# EasyEDA Pro project split36_left.eprj

# Schematic split1_left
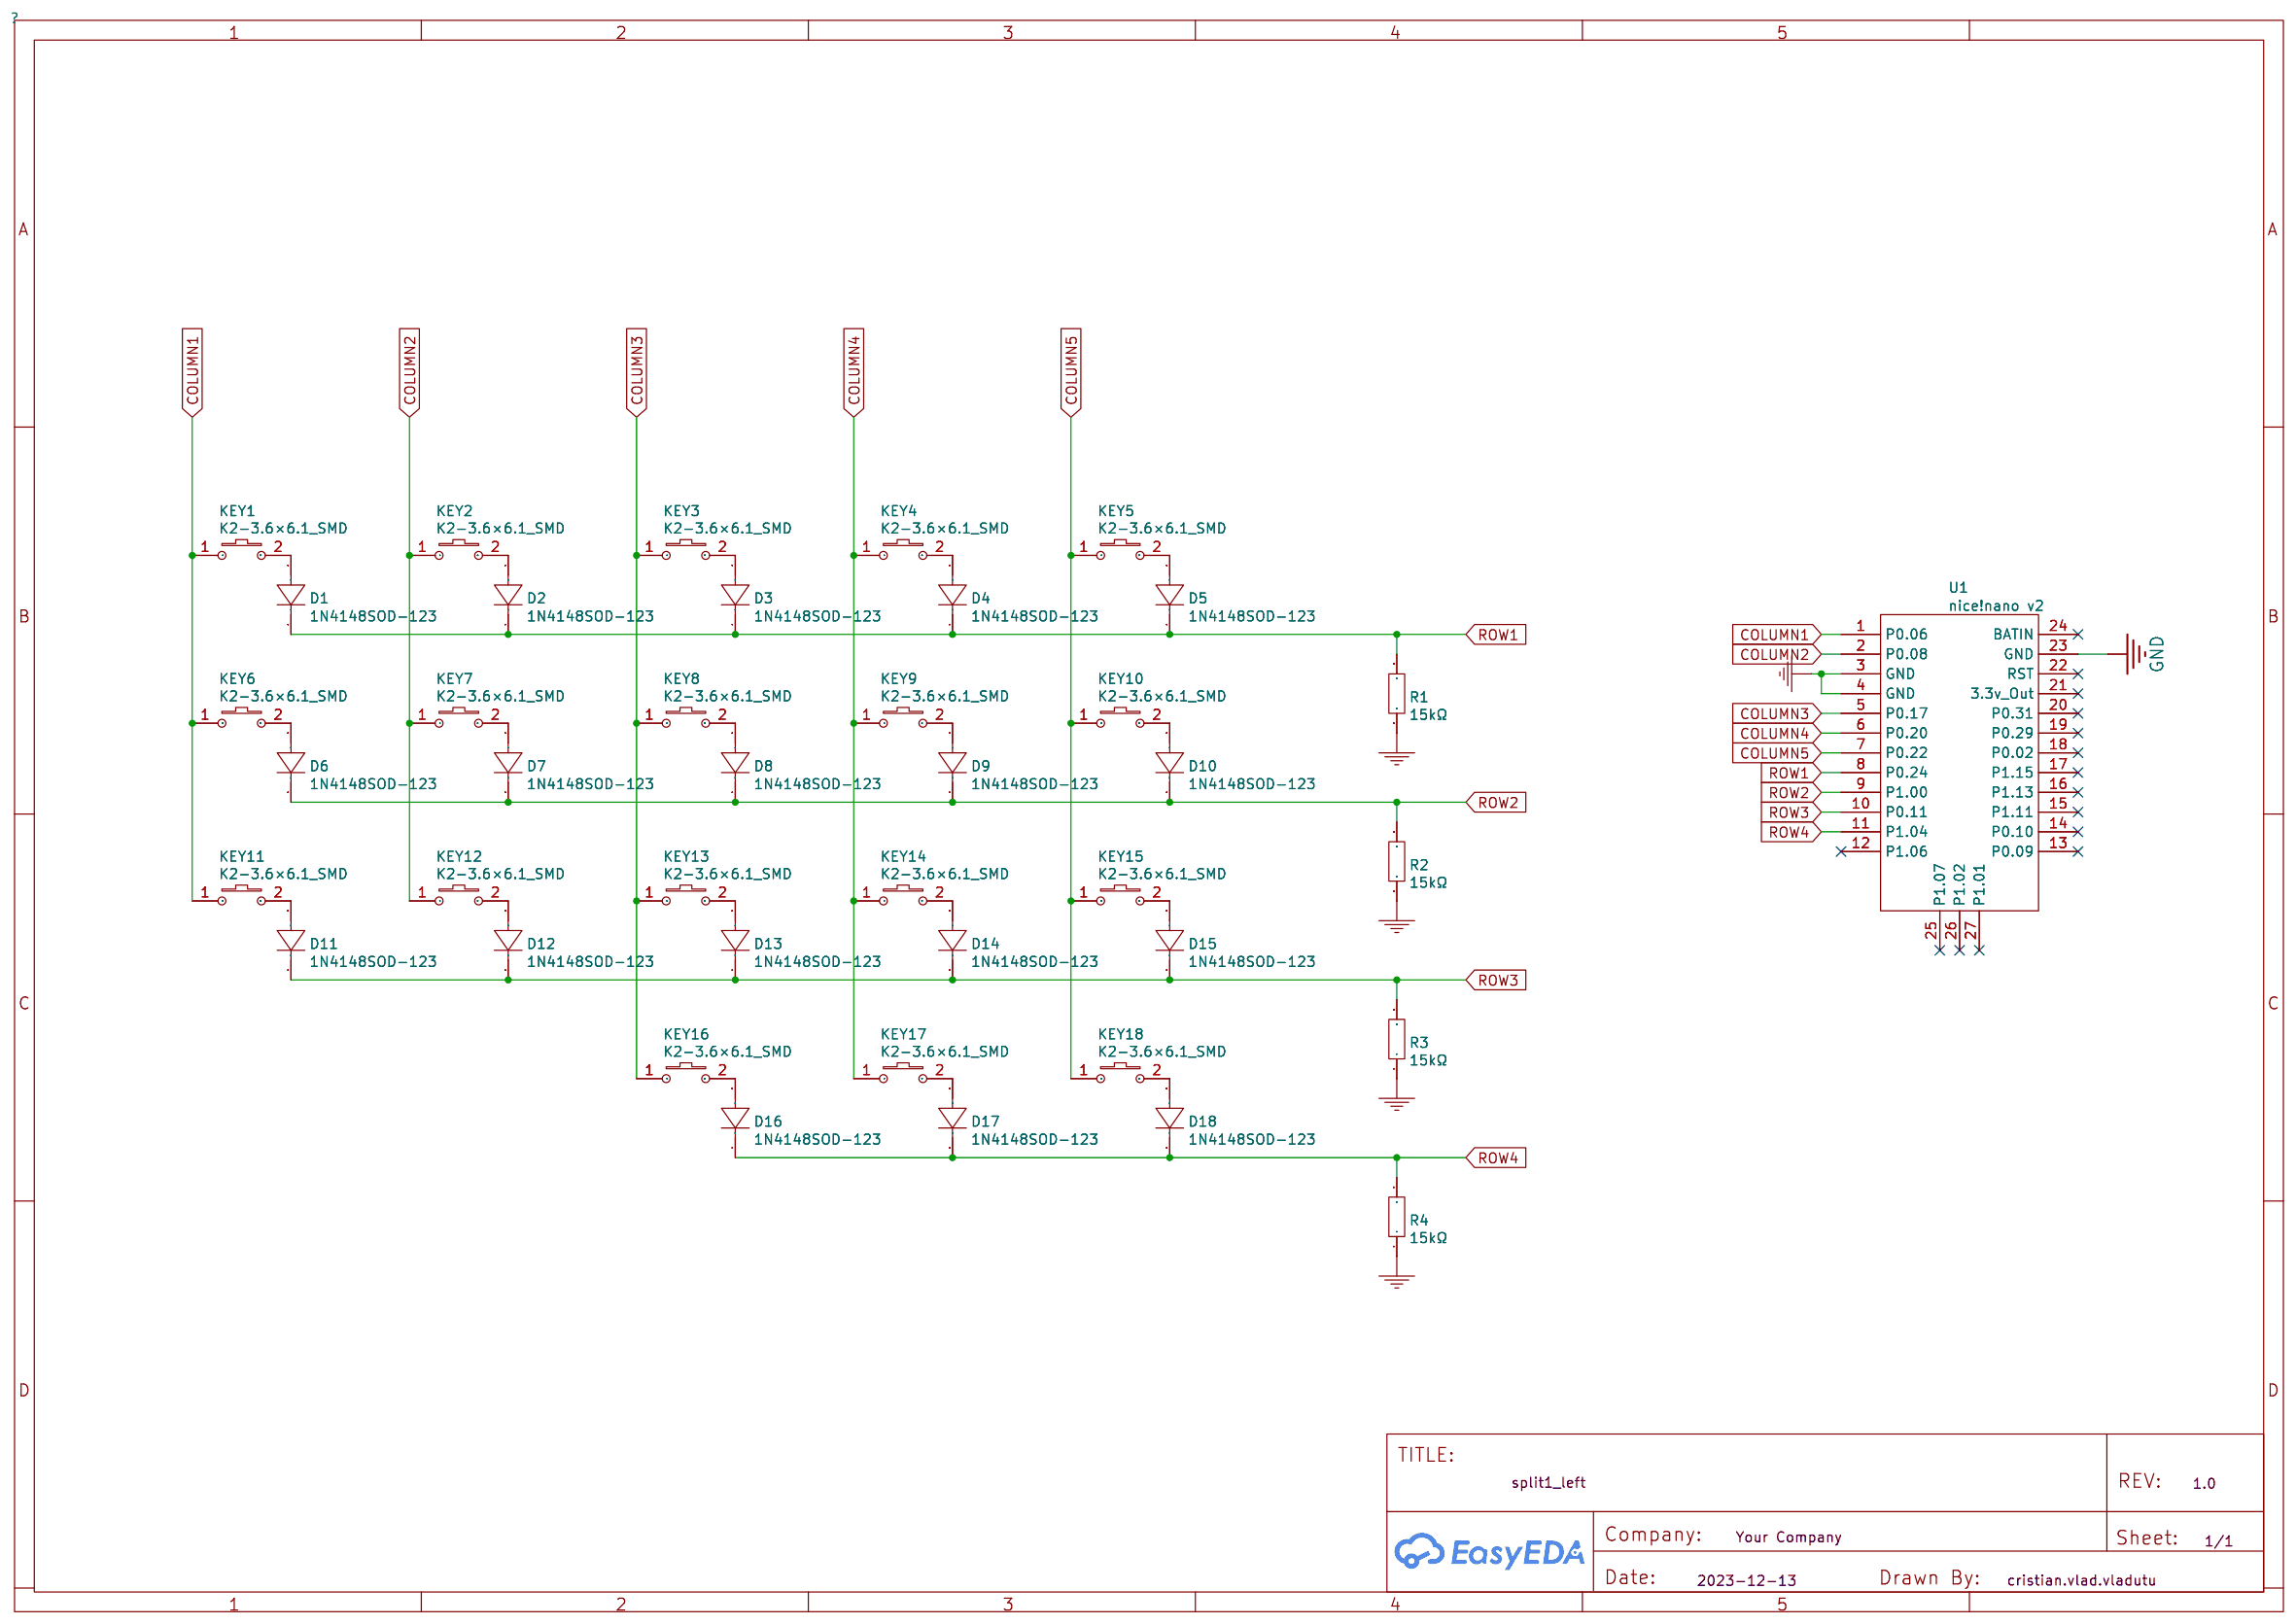
[diagram p0: schematic sheet]

## Parts
D1  1N4148SOD-123  [SOD-123_L2.6-W1.6-LS3.5-RD]
D2  1N4148SOD-123  [SOD-123_L2.6-W1.6-LS3.5-RD]
D3  1N4148SOD-123  [SOD-123_L2.6-W1.6-LS3.5-RD]
D4  1N4148SOD-123  [SOD-123_L2.6-W1.6-LS3.5-RD]
D5  1N4148SOD-123  [SOD-123_L2.6-W1.6-LS3.5-RD]
D6  1N4148SOD-123  [SOD-123_L2.6-W1.6-LS3.5-RD]
D7  1N4148SOD-123  [SOD-123_L2.6-W1.6-LS3.5-RD]
D8  1N4148SOD-123  [SOD-123_L2.6-W1.6-LS3.5-RD]
D9  1N4148SOD-123  [SOD-123_L2.6-W1.6-LS3.5-RD]
D10  1N4148SOD-123  [SOD-123_L2.6-W1.6-LS3.5-RD]
D11  1N4148SOD-123  [SOD-123_L2.6-W1.6-LS3.5-RD]
D12  1N4148SOD-123  [SOD-123_L2.6-W1.6-LS3.5-RD]
D13  1N4148SOD-123  [SOD-123_L2.6-W1.6-LS3.5-RD]
D14  1N4148SOD-123  [SOD-123_L2.6-W1.6-LS3.5-RD]
D15  1N4148SOD-123  [SOD-123_L2.6-W1.6-LS3.5-RD]
D16  1N4148SOD-123  [SOD-123_L2.6-W1.6-LS3.5-RD]
D17  1N4148SOD-123  [SOD-123_L2.6-W1.6-LS3.5-RD]
D18  1N4148SOD-123  [SOD-123_L2.6-W1.6-LS3.5-RD]
KEY1  K2-3.6×6.1_SMD  [GATERON LOW PROFILE SWITCH HOTSWAP LED]
KEY2  K2-3.6×6.1_SMD  [GATERON LOW PROFILE SWITCH HOTSWAP LED]
KEY3  K2-3.6×6.1_SMD  [GATERON LOW PROFILE SWITCH HOTSWAP LED]
KEY4  K2-3.6×6.1_SMD  [GATERON LOW PROFILE SWITCH HOTSWAP LED]
KEY5  K2-3.6×6.1_SMD  [GATERON LOW PROFILE SWITCH HOTSWAP LED]
KEY6  K2-3.6×6.1_SMD  [GATERON LOW PROFILE SWITCH HOTSWAP LED]
KEY7  K2-3.6×6.1_SMD  [GATERON LOW PROFILE SWITCH HOTSWAP LED]
KEY8  K2-3.6×6.1_SMD  [GATERON LOW PROFILE SWITCH HOTSWAP LED]
KEY9  K2-3.6×6.1_SMD  [GATERON LOW PROFILE SWITCH HOTSWAP LED]
KEY10  K2-3.6×6.1_SMD  [GATERON LOW PROFILE SWITCH HOTSWAP LED]
KEY11  K2-3.6×6.1_SMD  [GATERON LOW PROFILE SWITCH HOTSWAP LED]
KEY12  K2-3.6×6.1_SMD  [GATERON LOW PROFILE SWITCH HOTSWAP LED]
KEY13  K2-3.6×6.1_SMD  [GATERON LOW PROFILE SWITCH HOTSWAP LED]
KEY14  K2-3.6×6.1_SMD  [GATERON LOW PROFILE SWITCH HOTSWAP LED]
KEY15  K2-3.6×6.1_SMD  [GATERON LOW PROFILE SWITCH HOTSWAP LED]
KEY16  K2-3.6×6.1_SMD  [GATERON LOW PROFILE SWITCH HOTSWAP LED]
KEY17  K2-3.6×6.1_SMD  [GATERON LOW PROFILE SWITCH HOTSWAP LED]
KEY18  K2-3.6×6.1_SMD  [GATERON LOW PROFILE SWITCH HOTSWAP LED]
R1  15kΩ  [R0402]
R2  15kΩ  [R0402]
R3  15kΩ  [R0402]
R4  15kΩ  [R0402]
U1  nice!nano v2  [NICE!NANO V2]

## Library data of the parts
D1-D18 = 1N4148SOD-123: link: https://lcsc.com/eda_search?q=C2972760&amp;%26type=1&amp;ref=editor; Supplier: LCSC; Supplier Part: C2972760; Manufacturer: JKSEMI(金开盛); JLCPCB Part Class: Extended Part
KEY1-KEY18 = K2-3.6×6.1_SMD: Supplier Part: C118141; Supplier: LCSC; Manufacturer Part: K2-1107ST-A4SW-06; 制造商: 韩国韩荣
R1-R4 = 15kΩ: link: https://lcsc.com/eda_search?q=C325957&amp;%26type=1&amp;ref=editor; 3DModel: R0402_L1.0-W0.5-H0.5; Supplier: LCSC; Supplier Part: C325957; Manufacturer: Tyohm(幸亚电阻); Manufacturer Part: RMC040215K5%N; JLCPCB Part Class: Extended Part
U1 = nice!nano v2: link: https://nicekeyboards.com/docs/nice-nano/pinout-schematic; Manufacturer: nice!

## Nets
GND: R1.1 R2.1 R3.1 R4.1 U1.3(GND) U1.4(GND) U1.23(GND)
COLUMN1: KEY1.1 KEY6.1 KEY11.1 U1.1(P0.06)
COLUMN2: KEY2.1 KEY7.1 KEY12.1 U1.2(P0.08)
COLUMN3: KEY3.1 KEY8.1 KEY13.1 KEY16.1 U1.5(P0.17)
COLUMN4: KEY4.1 KEY9.1 KEY14.1 KEY17.1 U1.6(P0.20)
COLUMN5: KEY5.1 KEY10.1 KEY15.1 KEY18.1 U1.7(P0.22)
ROW1: D1.1(K) D2.1(K) D3.1(K) D4.1(K) D5.1(K) R1.2 U1.8(P0.24)
ROW2: D6.1(K) D7.1(K) D8.1(K) D9.1(K) D10.1(K) R2.2 U1.9(P1.00)
ROW3: D11.1(K) D12.1(K) D13.1(K) D14.1(K) D15.1(K) R3.2 U1.10(P0.11)
ROW4: D16.1(K) D17.1(K) D18.1(K) R4.2 U1.11(P1.04)
$1N745: D1.2(A) KEY1.2
$1N746: D2.2(A) KEY2.2
$1N747: D3.2(A) KEY3.2
$1N748: D4.2(A) KEY4.2
$1N749: D5.2(A) KEY5.2
$1N750: D10.2(A) KEY10.2
$1N751: D8.2(A) KEY8.2
$1N752: D7.2(A) KEY7.2
$1N753: D15.2(A) KEY15.2
$1N754: D14.2(A) KEY14.2
$1N755: D13.2(A) KEY13.2
$1N756: D12.2(A) KEY12.2
$1N757: D11.2(A) KEY11.2
$1N758: D16.2(A) KEY16.2
$1N759: D17.2(A) KEY17.2
$1N760: D18.2(A) KEY18.2
$1N761: D6.2(A) KEY6.2
$1N762: D9.2(A) KEY9.2

Not connected (* = marked no-connect by the designer): U1 12(P1.06)* 13(P0.09)* 14(P0.10)* 15(P1.11)* 16(P1.13)* 17(P1.15)* 18(P0.02)* 19(P0.29)* 20(P0.31)* 21(3.3v Out)* 22(RST)* 24(BATIN)* 25(P1.07)* 26(P1.02)* 27(P1.01)*

# Board PCB_split1_left
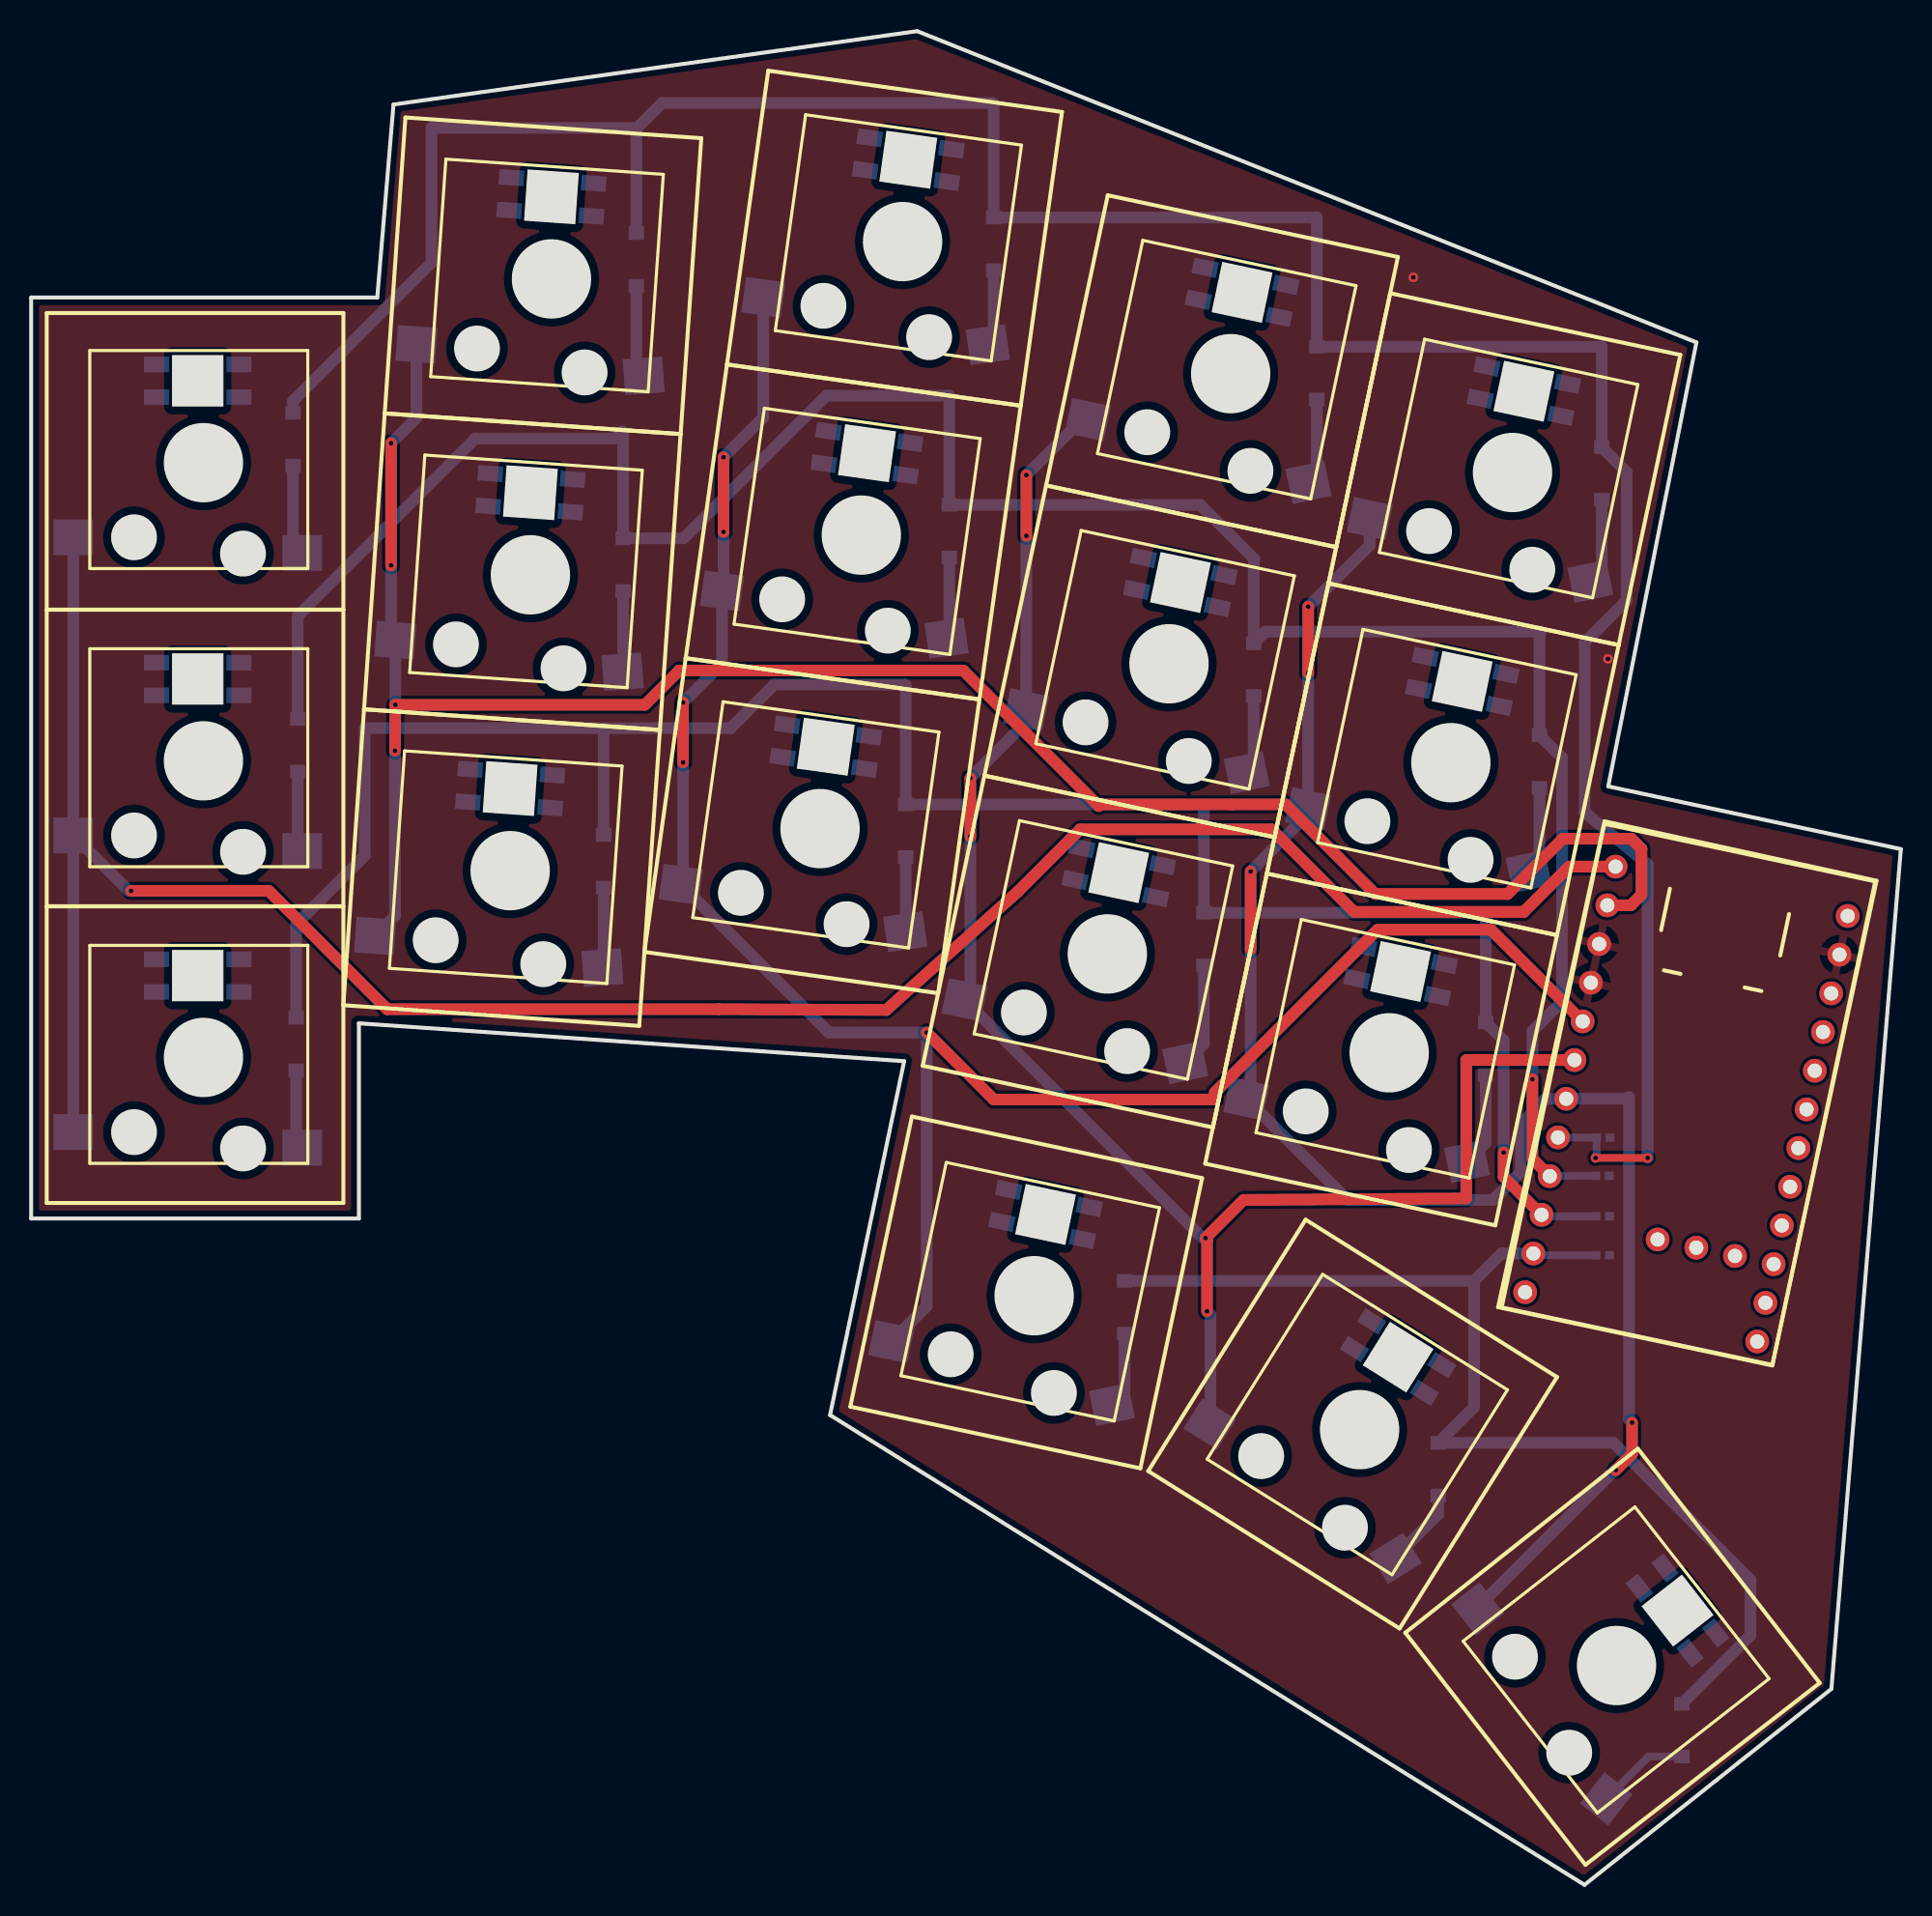
[diagram p1: board, top side]
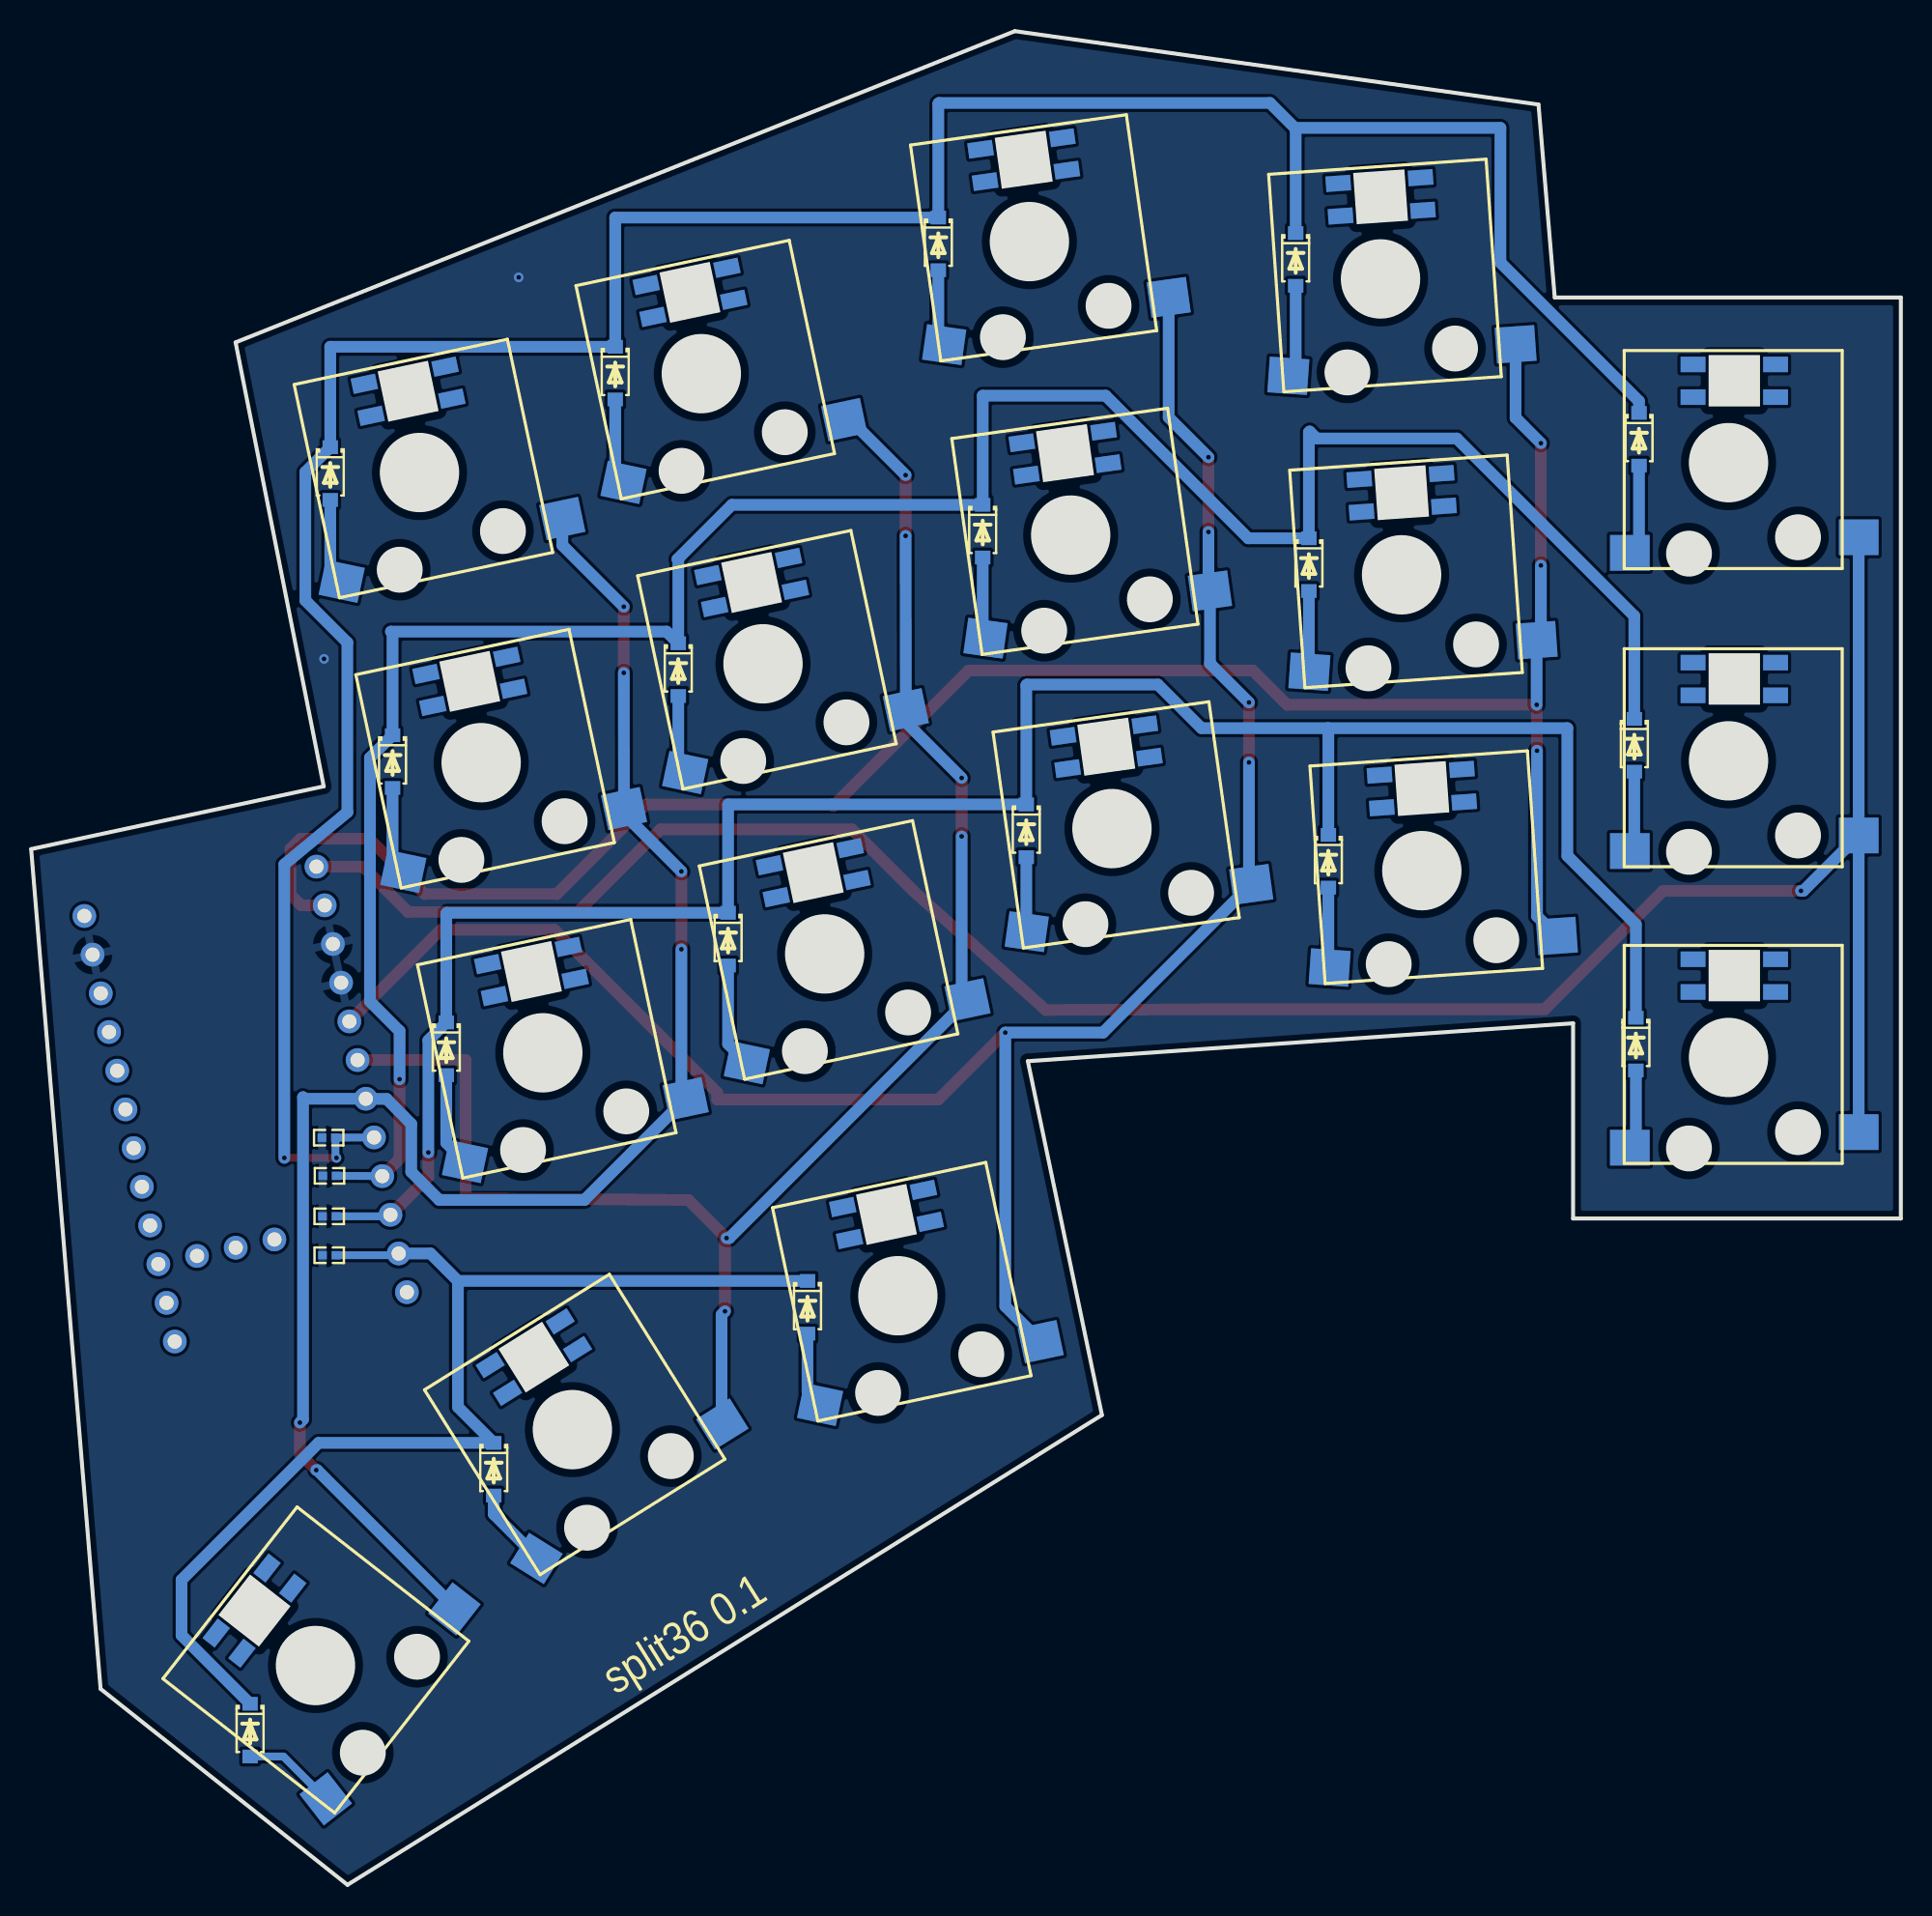
[diagram p2: board, bottom side, seen from below]

Outline 120.08 x 119.05 mm; copper layers: Top Layer, Bottom Layer. Coordinates in mm from the lower left corner of the outline.
Outline path: 0,101.94 22.23,101.94 23.27,114.34 56.9,119.05 106.95,99.06 101.29,70.55 120.08,66.52 115.62,12.59 99.76,0 51.31,30.17 56.07,52.9 21.05,55.33 21.05,42.79 0,42.79 0,101.94
Stack: Top Layer 0.035mm / Dielectric1 1.51mm FR4 er 4.5 / Bottom Layer 0.035mm

## Design rules (mm)
spacing Default (default): track to track 0.152, other pairs 0 to 0.152
track width Default (default): min 0.254, default 0.254, max 25.4
differential pair differentialPair (default): width min 0.127, default 0.254, max 2.54; gap min 0.152, default 0.152
via Default (default): diameter min 0.61, default 0.61, max 100.025; hole min 0.305, default 0.305, max 59.995
net GND uses gge22613(1)

## Placement (name value [footprint] x y rotation side)
D1  1N4148SOD-123  [SOD-123_L2.6-W1.6-LS3.5-RD]  16.82 92.84 270 bottom
D2  1N4148SOD-123  [SOD-123_L2.6-W1.6-LS3.5-RD]  38.87 104.39 270 bottom
D3  1N4148SOD-123  [SOD-123_L2.6-W1.6-LS3.5-RD]  61.82 105.39 270 bottom
D4  1N4148SOD-123  [SOD-123_L2.6-W1.6-LS3.5-RD]  82.57 97.09 270 bottom
D5  1N4148SOD-123  [SOD-123_L2.6-W1.6-LS3.5-RD]  100.87 90.64 270 bottom
D6  1N4148SOD-123  [SOD-123_L2.6-W1.6-LS3.5-RD]  17.12 73.19 270 bottom
D7  1N4148SOD-123  [SOD-123_L2.6-W1.6-LS3.5-RD]  38.02 84.79 270 bottom
D8  1N4148SOD-123  [SOD-123_L2.6-W1.6-LS3.5-RD]  58.97 86.94 270 bottom
D9  1N4148SOD-123  [SOD-123_L2.6-W1.6-LS3.5-RD]  78.52 78.04 270 bottom
D10  1N4148SOD-123  [SOD-123_L2.6-W1.6-LS3.5-RD]  96.87 72.14 270 bottom
D11  1N4148SOD-123  [SOD-123_L2.6-W1.6-LS3.5-RD]  17.02 53.99 270 bottom
D12  1N4148SOD-123  [SOD-123_L2.6-W1.6-LS3.5-RD]  36.77 65.74 270 bottom
D13  1N4148SOD-123  [SOD-123_L2.6-W1.6-LS3.5-RD]  56.17 67.69 270 bottom
D14  1N4148SOD-123  [SOD-123_L2.6-W1.6-LS3.5-RD]  75.32 60.74 270 bottom
D15  1N4148SOD-123  [SOD-123_L2.6-W1.6-LS3.5-RD]  93.42 53.69 270 bottom
D16  1N4148SOD-123  [SOD-123_L2.6-W1.6-LS3.5-RD]  70.22 37.09 270 bottom
D17  1N4148SOD-123  [SOD-123_L2.6-W1.6-LS3.5-RD]  90.37 26.69 270 bottom
D18  1N4148SOD-123  [SOD-123_L2.6-W1.6-LS3.5-RD]  106.02 9.94 270 bottom
KEY1  K2-3.6×6.1_SMD  [GATERON LOW PROFILE SWITCH HOTSWAP LED#2]  11.07 91.34 0 top
KEY2  K2-3.6×6.1_SMD  [GATERON LOW PROFILE SWITCH HOTSWAP LED]  33.42 103.14 356 top
KEY3  K2-3.6×6.1_SMD  [GATERON LOW PROFILE SWITCH HOTSWAP LED#3]  55.97 105.53 352 top
KEY4  K2-3.6×6.1_SMD  [GATERON LOW PROFILE SWITCH HOTSWAP LED#4]  77.04 97.05 348 top
KEY5  K2-3.6×6.1_SMD  [GATERON LOW PROFILE SWITCH HOTSWAP LED#4]  95.14 90.7 348 top
KEY6  K2-3.6×6.1_SMD  [GATERON LOW PROFILE SWITCH HOTSWAP LED#2]  11.07 72.19 0 top
KEY7  K2-3.6×6.1_SMD  [GATERON LOW PROFILE SWITCH HOTSWAP LED]  32.06 84.13 356 top
KEY8  K2-3.6×6.1_SMD  [GATERON LOW PROFILE SWITCH HOTSWAP LED#3]  53.31 86.68 352 top
KEY9  K2-3.6×6.1_SMD  [GATERON LOW PROFILE SWITCH HOTSWAP LED#4]  73.08 78.42 348 top
KEY10  K2-3.6×6.1_SMD  [GATERON LOW PROFILE SWITCH HOTSWAP LED#4]  91.18 72.07 348 top
KEY11  K2-3.6×6.1_SMD  [GATERON LOW PROFILE SWITCH HOTSWAP LED#2]  11.07 53.14 0 top
KEY12  K2-3.6×6.1_SMD  [GATERON LOW PROFILE SWITCH HOTSWAP LED]  30.76 65.13 356 top
KEY13  K2-3.6×6.1_SMD  [GATERON LOW PROFILE SWITCH HOTSWAP LED#3]  50.67 67.83 352 top
KEY14  K2-3.6×6.1_SMD  [GATERON LOW PROFILE SWITCH HOTSWAP LED#4]  69.12 59.79 348 top
KEY15  K2-3.6×6.1_SMD  [GATERON LOW PROFILE SWITCH HOTSWAP LED#4]  87.22 53.44 348 top
KEY16  K2-3.6×6.1_SMD  [GATERON LOW PROFILE SWITCH HOTSWAP LED#4]  64.41 37.83 348 top
KEY17  K2-3.6×6.1_SMD  [GATERON LOW PROFILE SWITCH HOTSWAP LED#5]  85.32 29.24 328 top
KEY18  K2-3.6×6.1_SMD  [GATERON LOW PROFILE SWITCH HOTSWAP LED#6]  101.82 14.09 308 top
R1  15kΩ  [R0402]  100.97 47.99 180 bottom
R2  15kΩ  [R0402]  100.92 45.54 180 bottom
R3  15kΩ  [R0402]  100.93 42.94 180 bottom
R4  15kΩ  [R0402]  100.93 40.44 180 bottom
U1  nice!nano v2  [NICE!NANO V2]  106.57 51.39 348 top

## Footprints (pads in the part's own frame, mm; a bottom-side part is the same pattern mirrored in y, then rotated)
GATERON LOW PROFILE SWITCH HOTSWAP LED
  rect 2.55x2.3 smd far side: 1(-8.36,-4.792)
  custom 2.55x2.3 smd far side rot 8: 2(6.34,-5.792)
  rect 1.6x1 smd far side: B(-3.02,4.208) G(2.28,4.208) GND(-3.02,6.308) R(2.28,6.308)
GATERON LOW PROFILE SWITCH HOTSWAP LED#2
  rect 2.55x2.3 smd far side: 1(-8.36,-4.792)
  custom 2.55x2.3 smd far side: 2(6.34,-5.792)
  rect 1.6x1 smd far side: B(-3.02,4.208) G(2.28,4.208) GND(-3.02,6.308) R(2.28,6.308)
GATERON LOW PROFILE SWITCH HOTSWAP LED#3
  rect 2.55x2.3 smd far side: 1(-8.36,-4.792)
  custom 2.55x2.3 smd far side rot 16: 2(6.34,-5.792)
  rect 1.6x1 smd far side: B(-3.02,4.208) G(2.28,4.208) GND(-3.02,6.308) R(2.28,6.308)
GATERON LOW PROFILE SWITCH HOTSWAP LED#4
  rect 2.55x2.3 smd far side: 1(-8.36,-4.792)
  custom 2.55x2.3 smd far side rot 24: 2(6.34,-5.792)
  rect 1.6x1 smd far side: B(-3.02,4.208) G(2.28,4.208) GND(-3.02,6.308) R(2.28,6.308)
GATERON LOW PROFILE SWITCH HOTSWAP LED#5
  rect 2.55x2.3 smd far side: 1(-8.36,-4.792)
  custom 2.55x2.3 smd far side rot 64: 2(6.34,-5.792)
  rect 1.6x1 smd far side: B(-3.02,4.208) G(2.28,4.208) GND(-3.02,6.308) R(2.28,6.308)
GATERON LOW PROFILE SWITCH HOTSWAP LED#6
  rect 2.55x2.3 smd far side: 1(-8.36,-4.792)
  custom 2.55x2.3 smd far side rot 104: 2(6.34,-5.792)
  rect 1.6x1 smd far side: B(-3.02,4.208) G(2.28,4.208) GND(-3.02,6.308) R(2.28,6.308)
NICE!NANO V2
  round 1.524 hole 0.914: 1(-7.62,12.7) 2(-7.62,10.16) 3(-7.62,7.62) 4(-7.62,5.08) 5(-7.62,2.54) 6(-7.62,0) 7(-7.62,-2.54) 8(-7.62,-5.08) 9(-7.62,-7.62) 10(-7.62,-10.16) 11(-7.62,-12.7) 12(-7.62,-15.24) 13(7.62,-15.24) 14(7.62,-12.7) 15(7.62,-10.16) 16(7.62,-7.62) 17(7.62,-5.08) 18(7.62,-2.54) 19(7.62,0) 20(7.62,2.54) 21(7.62,5.08) 22(7.62,7.62) 23(7.62,10.16) 24(7.62,12.7) 25(0,-10.16) 26(2.54,-10.16) 27(5.08,-10.16)
R0402
  rect 0.566x0.54 smd: 1(-0.433,0) 2(0.433,0)
SOD-123_L2.6-W1.6-LS3.5-RD
  rect 0.88x0.99 smd: 1(-1.692,0) 2(1.692,0)

## Nets
As in the schematic.

Pads without a net: KEY1 B G GND R; KEY2 B G GND R; KEY3 B G GND R; KEY4 B G GND R; KEY5 B G GND R; KEY6 B G GND R; KEY7 B G GND R; KEY8 B G GND R; KEY9 B G GND R; KEY10 B G GND R; KEY11 B G GND R; KEY12 B G GND R; KEY13 B G GND R; KEY14 B G GND R; KEY15 B G GND R; KEY16 B G GND R; KEY17 B G GND R; KEY18 B G GND R; U1 12 13 14 15 16 17 18 19 20 21 22 24 25 26 27

## Via types
v1: diameter 0.62, hole 0.31, Top Layer to Bottom Layer, 28 vias

## Routing (per net, layer and track width the routed paths; a pad name or vN(x,y) marks a point on that pad's centre or on a via; arc(x,y) is an arc through that point)
GND:
  vias: v1(88.77,103.24) v1(101.27,78.74)
COLUMN1: length 149.7
  Top Layer w0.75: 6.42,63.84 15.27,63.84 22.87,56.24 44.17,56.24 54.92,56.19 63.37,63.79 67.37,67.79 79.67,67.79 84.97,62.49 95.87,62.49 98.77,65.39 101.75,65.39
  Bottom Layer w0.75: KEY6.1 6.27,63.84 v1(6.42,63.84) ; KEY6.1 2.71,86.44 ; KEY6.1 KEY11.1
COLUMN2: length 133.4
  Top Layer w0.75: v1(23.12,92.59) v1(23.12,84.74) ; v1(23.37,72.84) v1(23.39,75.79) 39.42,75.79 41.62,77.99 59.87,77.99 68.57,69.29 68.67,69.39 77.07,69.39 80.57,69.39 86.32,63.64 94.82,63.64 98.37,67.19 102.77,67.19 103.42,66.54 103.42,63.59 102.74,62.91 101.23,62.91
  Bottom Layer w0.75: v1(23.12,84.74) 23.12,80.21 KEY7.1 v1(23.39,75.79) ; KEY2.1 24.74,94.21 v1(23.12,92.59) ; v1(23.37,72.84) 23.37,62.21 KEY12.1
COLUMN3: length 131.5
  Top Layer w0.75: v1(57.52,54.74) 61.82,50.44 76.02,50.44 76.02,50.89 86.47,61.34 93.76,61.34 99.64,55.45 ; v1(44.47,91.69) v1(44.47,86.89) ; v1(41.87,75.94) v1(41.87,72.09)
  Bottom Layer w0.75: v1(44.47,91.69) 47.02,94.24 KEY3.1 ; v1(41.87,75.94) 44.37,78.44 KEY8.1 44.47,83.2 v1(44.47,86.89) ; v1(41.87,72.09) 41.87,64.4 41.72,64.25 51.24,54.74 v1(57.52,54.74) 57.52,37.16 KEY16.1
COLUMN4: length 108.1
  Top Layer w0.75: v1(63.92,90.54) v1(63.92,86.64) ; v1(60.32,71.09) v1(60.32,67.34) ; v1(75.52,36.84) 75.52,41.44 v1(75.42,41.54) 77.87,43.99 92.17,44.08 92.17,52.97 U1.6
  Bottom Layer w0.75: KEY4.1 67.48,94.1 v1(63.92,90.54) ; v1(75.52,36.84) 75.74,36.62 75.74,29.75 ; v1(60.32,67.34) 60.32,57.21 KEY14.1 75.24,41.54 v1(75.42,41.54) ; v1(60.32,71.09) 63.9,74.67 KEY9.1 63.92,86.63
COLUMN5: length 109.1
  Top Layer w0.75: v1(82.02,82.09) v1(82.02,77.84) ; v1(101.77,26.64) 102.82,27.69 v1(102.82,29.69) ; v1(78.32,65.09) v1(78.32,60.09)
  Bottom Layer w0.75: v1(101.77,26.64) 101.71,26.64 93.09,18.02 ; v1(78.32,65.09) 82,68.77 KEY10.1 82.02,77.84 ; v1(102.82,29.69) 102.62,29.89 102.62,50.59 102.52,50.49 U1.7 97.24,50.47 95.67,48.87 95.67,45.78 93.87,43.99 84.54,43.99 KEY15.1 78.32,50.76 v1(78.32,60.09) ; v1(82.02,82.09) 85.96,86.03 KEY5.1
ROW1: length 183.1
  Top Layer w0.5: v1(103.82,46.69) v1(100.47,46.69)
  Bottom Layer w0.5: 98.06,48 100.53,47.99 ; R1.2 100.53,46.75 v1(100.47,46.69)
  Bottom Layer w0.75: 61.82,107.08 82.57,107.08 82.57,98.78 ; 38.92,112.84 38.87,112.79 D2.1 ; 38.92,112.84 25.72,112.84 25.72,104.19 16.82,95.29 D1.1 ; 38.92,112.84 40.52,114.44 61.77,114.44 61.82,114.39 D3.1 ; v1(103.82,46.69) 103.82,65.54 99.77,68.89 99.77,79.78 102.47,82.48 102.47,90.73 D5.1 100.87,98.78 D4.1
ROW2: length 156
  Top Layer w0.75: v1(96.42,51.74) 96.42,46.63 U1.9
  Bottom Layer w0.5: 97.53,45.52 R2.2
  Bottom Layer w0.75: D6.1 17.12,81.49 28.52,92.89 37.52,92.89 37.97,93.34 38.02,93.29 D7.1 41.91,86.48 51.07,95.64 58.97,95.64 D8.1 75.07,88.63 78.57,85.14 78.52,85.09 D9.1 79.27,80.49 96.97,80.49 96.87,80.39 D10.1 98.32,72.38 98.32,56.74 96.42,54.84 v1(96.42,51.74)
ROW3: length 139.5
  Top Layer w0.75: U1.10 94.57,45.47 v1(94.57,47.04)
  Bottom Layer w0.5: R3.2 97.1,42.94 U1.10
  Bottom Layer w0.75: 36.82,74.29 36.77,74.24 D12.1 ; 36.82,74.29 44.92,74.29 47.72,77.09 56.12,77.09 56.17,77.04 D13.1 75.32,69.39 D14.1 93.37,62.43 93.42,62.38 D15.1 94.57,54.24 v1(94.57,47.04) ; 36.82,74.29 21.42,74.29 21.42,66.09 17.02,61.69 D11.1
ROW4: length 75.9
  Bottom Layer w0.5: R4.2 96.58,40.44 U1.11
  Bottom Layer w0.75: D18.1 110.42,16.03 110.42,19.59 101.62,28.39 D17.1 92.67,30.69 92.67,38.79 ; 92.67,38.79 94.43,40.55 U1.11 ; 92.67,38.79 D16.1
$1N745: length 5.9
  Bottom Layer w0.75: 17.41,85.44 16.82,86.03 D1.2
$1N746: length 6
  Bottom Layer w0.75: D2.2 38.87,97.39 KEY2.2
$1N747: length 4.9
  Bottom Layer w0.75: D3.2 61.82,99.29 KEY3.2
$1N748: length 5.5
  Bottom Layer w0.75: D4.2 82.57,90.6 KEY4.2
$1N749: length 5.5
  Bottom Layer w0.75: 100.13,83.72 100.87,84.45 D5.2
$1N750: length 5.6
  Bottom Layer w0.75: KEY10.2 96.87,65.78 D10.2
$1N751: length 5.3
  Bottom Layer w0.75: D8.2 58.97,80.25 KEY8.2
$1N752: length 5.2
  Bottom Layer w0.75: D7.2 38.02,77.94 KEY7.2
$1N753: length 6
  Bottom Layer w0.75: KEY15.2 93.42,47.65 93.42,52
$1N754: length 6.7
  Bottom Layer w0.75: D14.2 75.32,54 KEY14.2
$1N755: length 4.8
  Bottom Layer w0.75: 56.14,61.22 56.17,61.25 D13.2
$1N756: length 5.2
  Bottom Layer w0.75: 36.69,58.91 36.77,59 D12.2
$1N757: length 5.1
  Bottom Layer w0.75: 17.02,52.3 17.02,47.73 KEY11.2
$1N758: length 4.9
  Bottom Layer w0.75: KEY16.2 70.22,31.66 D16.2
$1N759: length 5
  Bottom Layer w0.75: 90.37,25 90.37,23.81 87.67,21.11
$1N760: length 6
  Bottom Layer w0.5: 101.16,5.52 103.88,8.24 D18.2
$1N761: length 5.2
  Bottom Layer w0.75: KEY6.2 17.12,66.68 D6.2
$1N762: length 5.1
  Bottom Layer w0.75: KEY9.2 78.52,71.88 D9.2

## Copper pours and planes (outline as drawn; the poured copper is in the pictures)
GND on Top Layer: -11.68,122.79 127.82,122.79 133.32,117.29 133.32,5.79 107.32,-20.21 -0.18,-20.21 -12.18,-8.21 -12.18,122.29
GND on Bottom Layer: -15.53,124.04 123.97,124.04 129.47,118.54 129.47,7.04 103.47,-18.96 -4.03,-18.96 -16.03,-6.96 -16.03,123.54

## Text on the board
Bottom Silkscreen Layer: split36 0.1
